# Altium project SmartGarden_PCB.PrjPcb (part 3 of 3)
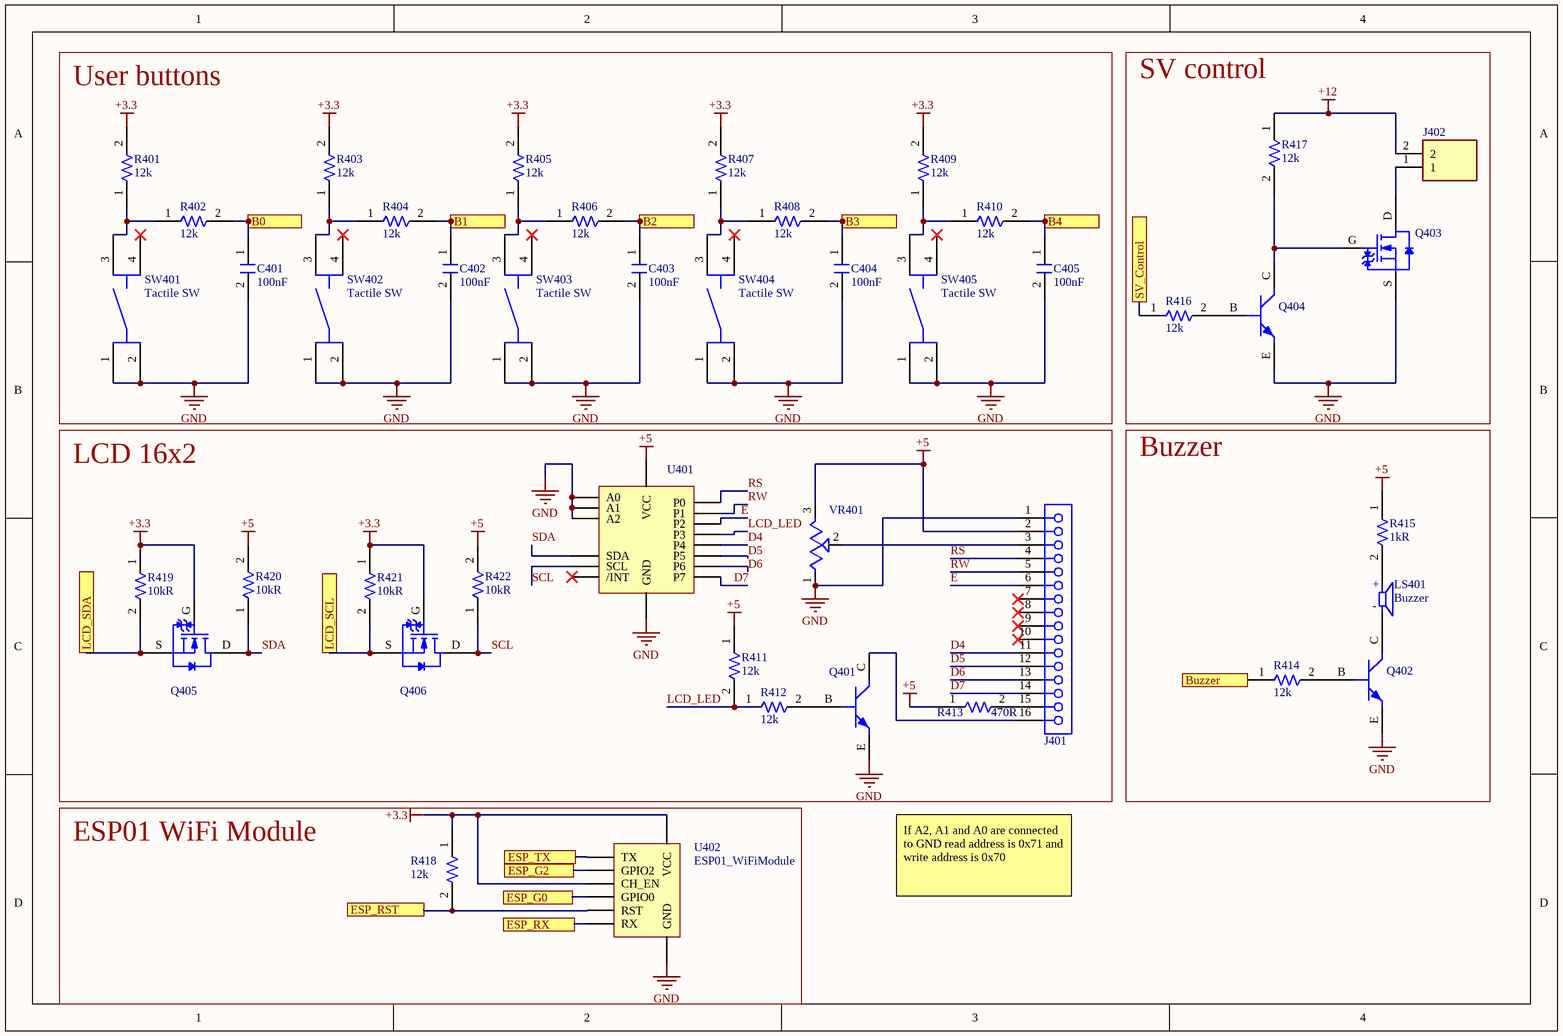
[diagram p5: [4]Actuators.SchDoc]

## Nets that join several sheets
+3.3: SmartGarden_PCB (J2.2 J3.1 J3.2 R1.1), [1]Supply (C106.1 R103.2 U101.2 U101.4), [2]MCU (11 pins), [3]Sensors (13 pins), [4]Actuators (12 pins)
+5: [1]Supply (5 pins), [3]Sensors (C308.1 U301.4), [4]Actuators (8 pins)
+12: SmartGarden_PCB (J1.1), [1]Supply (6 pins), [4]Actuators (J402.2 R417.1)
GND: SmartGarden_PCB (8 pins), [1]Supply (12 pins), [2]MCU (18 pins), [3]Sensors (22 pins), [4]Actuators (26 pins)
/MCLR: SmartGarden_PCB (J2.1 R1.2), [2]MCU (U201.7)
DPS_SCL: [2]MCU (R206.2 U201.37), [3]Sensors (S301.4), [4]Actuators (Q406.S R421.2)
DPS_SDA: [2]MCU (R207.2 U201.36), [3]Sensors (S301.3), [4]Actuators (Q405.S R419.2)
GH_D: [2]MCU (U201.8), [3]Sensors (R318.2 R320.1)
GH_Vout: [2]MCU (U201.17), [3]Sensors (C305.1 R311.2 R312.1 U301.12)
HR_Vout: [2]MCU (U201.11), [3]Sensors (C301.1 R303.2 R304.1)
LDR_Vout: [2]MCU (U201.13), [3]Sensors (C303.1 R307.2 R308.1)
NetC401_1: [2]MCU (U201.35), [4]Actuators (C401.1 R402.2)
NetC402_1: [2]MCU (U201.42), [4]Actuators (C402.1 R404.2)
NetC403_1: [2]MCU (U201.43), [4]Actuators (C403.1 R406.2)
NetC404_1: [2]MCU (U201.44), [4]Actuators (C404.1 R408.2)
NetC405_1: [2]MCU (U201.45), [4]Actuators (C405.1 R410.2)
NetR414_1: [2]MCU (U201.46), [4]Actuators (R414.1)
NetR416_1: [2]MCU (U201.58), [4]Actuators (R416.1)
NetR418_2: [2]MCU (U201.64), [4]Actuators (R418.2 U402.6)
NetU201_33: [2]MCU (U201.33), [4]Actuators (U402.7)
NetU201_34: [2]MCU (U201.34), [4]Actuators (U402.2)
NetU201_62: [2]MCU (U201.62), [4]Actuators (U402.5)
NetU201_63: [2]MCU (U201.63), [4]Actuators (U402.3)
NTC_Vadc: [2]MCU (U201.12), [3]Sensors (R316.2 U301.7)
PGEC1: SmartGarden_PCB (J2.5), [2]MCU (U201.15)
PGED1: SmartGarden_PCB (J2.4), [2]MCU (U201.16)
Rain_D: [2]MCU (U201.6), [3]Sensors (R317.2 R319.1)
Rain_Vout: [2]MCU (U201.14), [3]Sensors (C304.1 R309.2 R310.1 U301.10)
RD1: SmartGarden_PCB (J3.3), [2]MCU (U201.49)
RD2: SmartGarden_PCB (J3.5), [2]MCU (U201.50)
RD3: SmartGarden_PCB (J3.7), [2]MCU (U201.51)
RD4: SmartGarden_PCB (J3.6), [2]MCU (U201.52)
RD5: SmartGarden_PCB (J3.4), [2]MCU (U201.53)